# EAGLE schematic PVsystem-oct31-2020 (EAGLE 9.6.2)
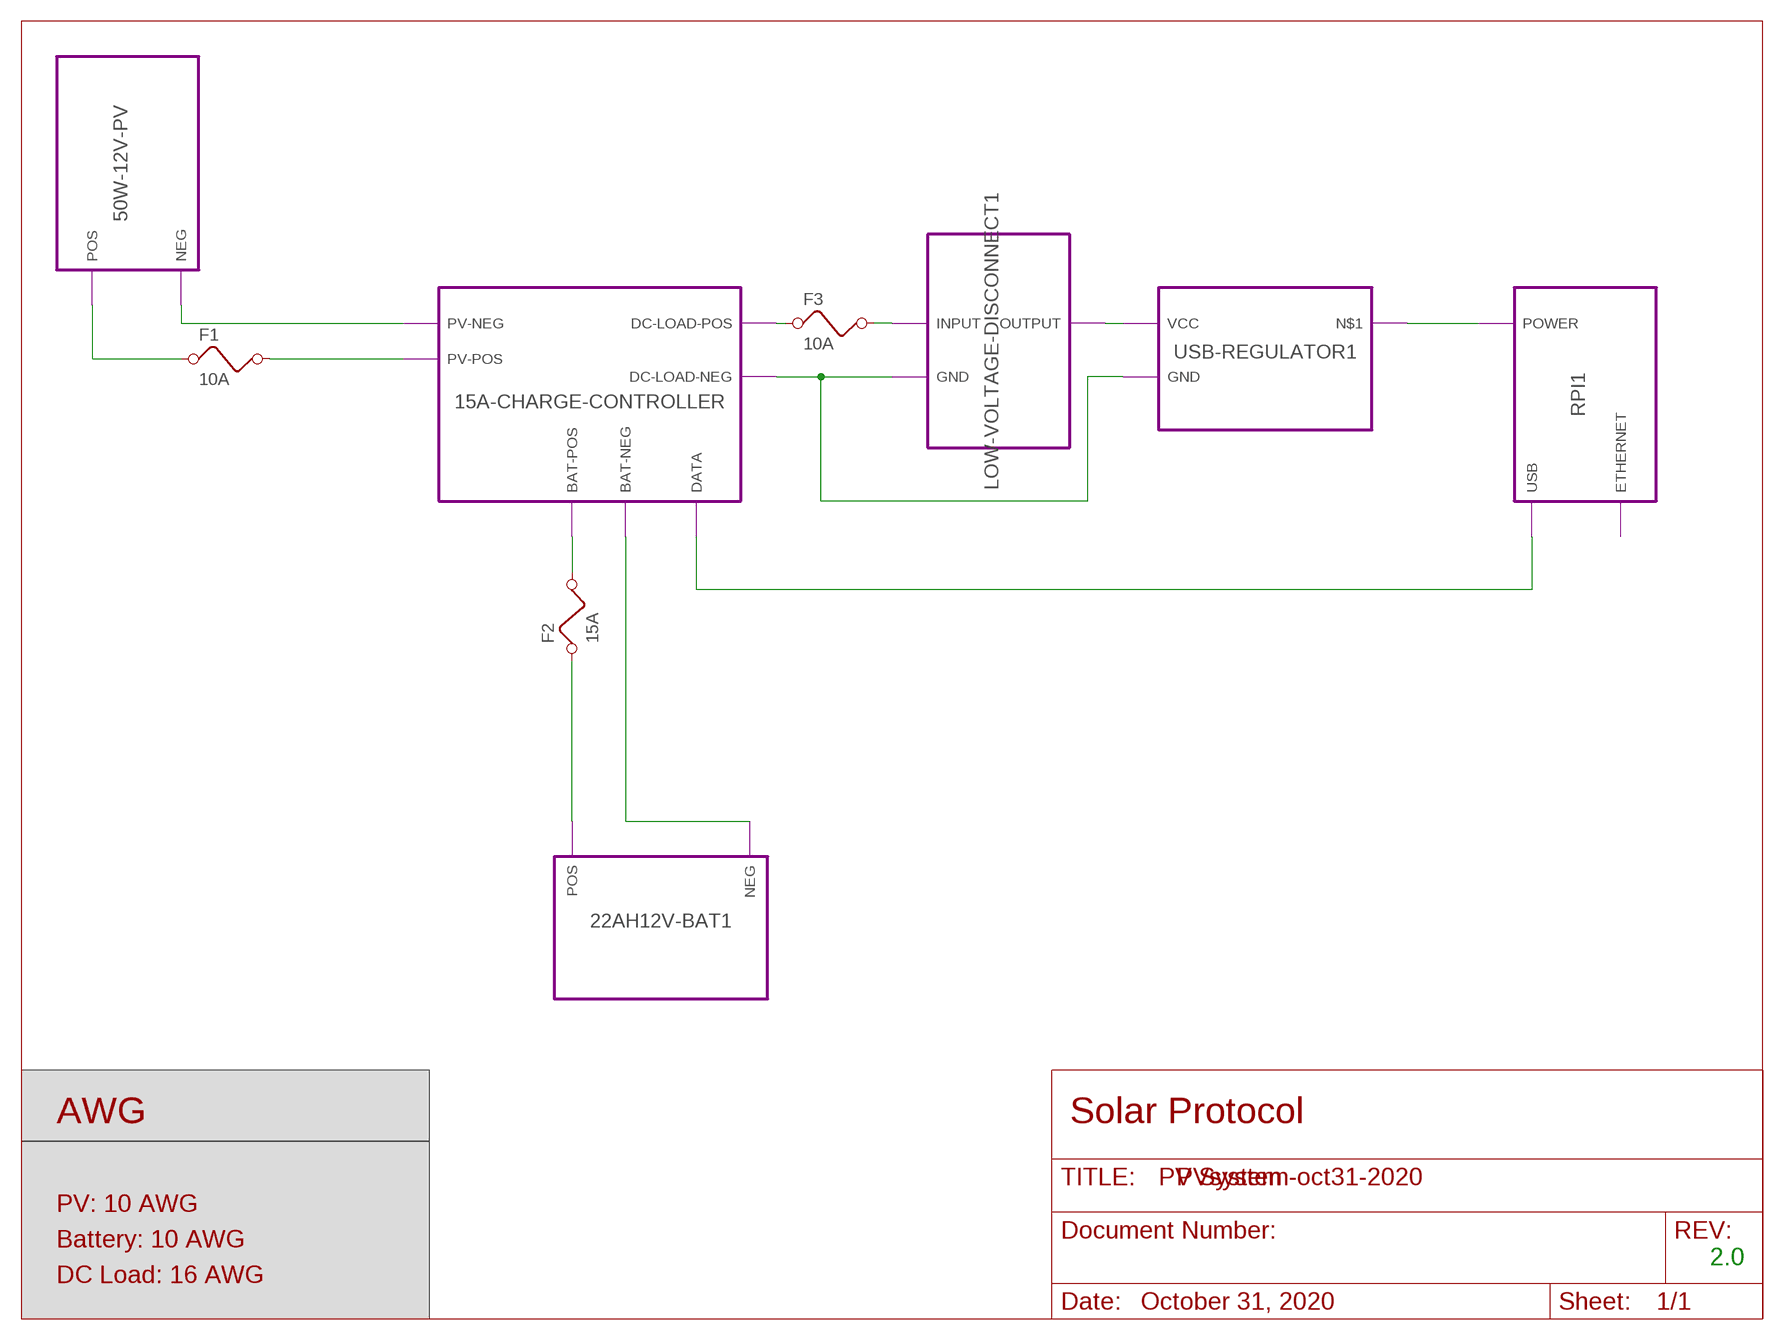
[diagram p0: schematic, sheet 1]

## Parts
F1  10A  FUSE  [FUSE]
F2  15A  FUSE  [FUSE]
F3  10A  FUSE  [FUSE]

## Module instances
50W-12V-PV = 50W-12V-PV
15A-CHARGE-CONTROLLER = CHARGE-CONTROLLER
22AH12V-BAT1 = 22AH12V-BAT
USB-REGULATOR1 = USB-REGULATOR
LOW-VOLTAGE-DISCONNECT1 = LOW-VOLTAGE-DISCONNECT
RPI1 = RPI

## Nets
4AWG: F2.1 ; port 22AH12V-BAT1.POS
10AWG: F1.1 ; port 50W-12V-PV.POS
N$1: port 50W-12V-PV.NEG 15A-CHARGE-CONTROLLER.PV-NEG
N$2: F2.2 ; port 15A-CHARGE-CONTROLLER.BAT-POS
N$3: port 15A-CHARGE-CONTROLLER.BAT-NEG 22AH12V-BAT1.NEG
N$4: F1.2 ; port 15A-CHARGE-CONTROLLER.PV-POS
N$5: port LOW-VOLTAGE-DISCONNECT1.OUTPUT USB-REGULATOR1.VCC
N$6: F3.1 ; port 15A-CHARGE-CONTROLLER.DC-LOAD-POS
N$7: port LOW-VOLTAGE-DISCONNECT1.GND USB-REGULATOR1.GND 15A-CHARGE-CONTROLLER.DC-LOAD-NEG
N$8: F3.2 ; port LOW-VOLTAGE-DISCONNECT1.INPUT
N$9: port USB-REGULATOR1.N$1 RPI1.POWER
N$10: port RPI1.USB 15A-CHARGE-CONTROLLER.DATA

## Notes on the sheet
- AWG | Solar Protocol
- PV System
- PV: 10 AWG
- Battery: 10 AWG
- 2.0
- DC Load: 16 AWG
- October 31, 2020

## Library data of the parts
F1-F3 = special:FUSE: FUSE 5 x 20 mm

## Module 50W-12V-PV
Ports: POS(io) NEG(io)

### Library data of the parts

## Module CHARGE-CONTROLLER
Ports: PV-POS(io) PV-NEG(io) BAT-POS(io) BAT-NEG(io) DC-LOAD-POS(io) DC-LOAD-NEG(io) DATA(io)

### Library data of the parts

## Module 22AH12V-BAT
Ports: POS(io) NEG(io)

### Library data of the parts

## Module USB-REGULATOR
Ports: VCC(io) GND(io) N$1(io)
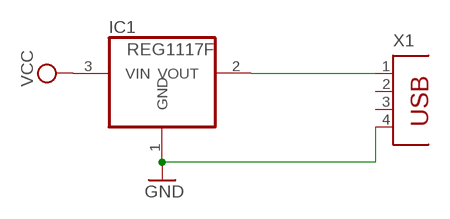
[diagram p1: schematic, module USB-REGULATOR, sheet 1]

### Parts
IC1  REG1117F  [DD-3]
X1  PN61729  [PN61729]

### Nets
GND: IC1.1(GND) X1.4
N$1: IC1.2(VOUT) X1.1
VCC: IC1.3(VIN)
Unconnected: X1.2 X1.3

### Library data of the parts
IC1 = burr-brown:REG1117: 800mA and 1A Low Dropout (LDO) Positive Regulator 1.8V, 2.5V, 2.85V, 3.3V, 5V, and Adj; MF: TEXAS INSTRUMENTS; MPN: REG1117FAKTTT; OC_FARNELL: 1296120; OC_NEWARK: 87H2562
X1 = con-berg:PN61729: BERG USB connector; OC_FARNELL: unknown; OC_NEWARK: unknown

## Module LOW-VOLTAGE-DISCONNECT
Ports: OUTPUT(io) INPUT(io) GND(io)

### Library data of the parts

## Module RPI
Ports: USB(io) ETHERNET(io) POWER(io)
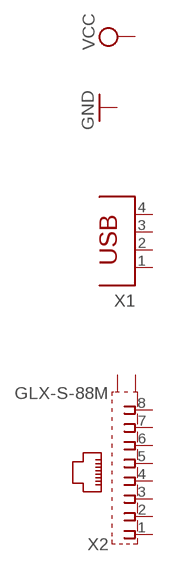
[diagram p2: schematic, module RPI, sheet 1]

### Parts
X1  PN61729  [PN61729]
X2  GLX-S-88M  [GLX-S-88M]
Unconnected: X1.1 X1.2 X1.3 X1.4 X2.1 X2.2 X2.3 X2.4 X2.5 X2.6 X2.7 X2.8 X2.S1 X2.S2

### Library data of the parts
X1 = con-berg:PN61729: BERG USB connector; OC_FARNELL: unknown; OC_NEWARK: unknown
X2 = con-kycon:GLX-S-88M: Mod. Jack, Right Angle, 8 posiotion, 8 contatcs RJ45 Source: GLX-S-88M.pdf; OC_FARNELL: unknown; OC_NEWARK: unknown